# EAGLE design Touch_Drum_V1_Simple (EAGLE 7.7.0)
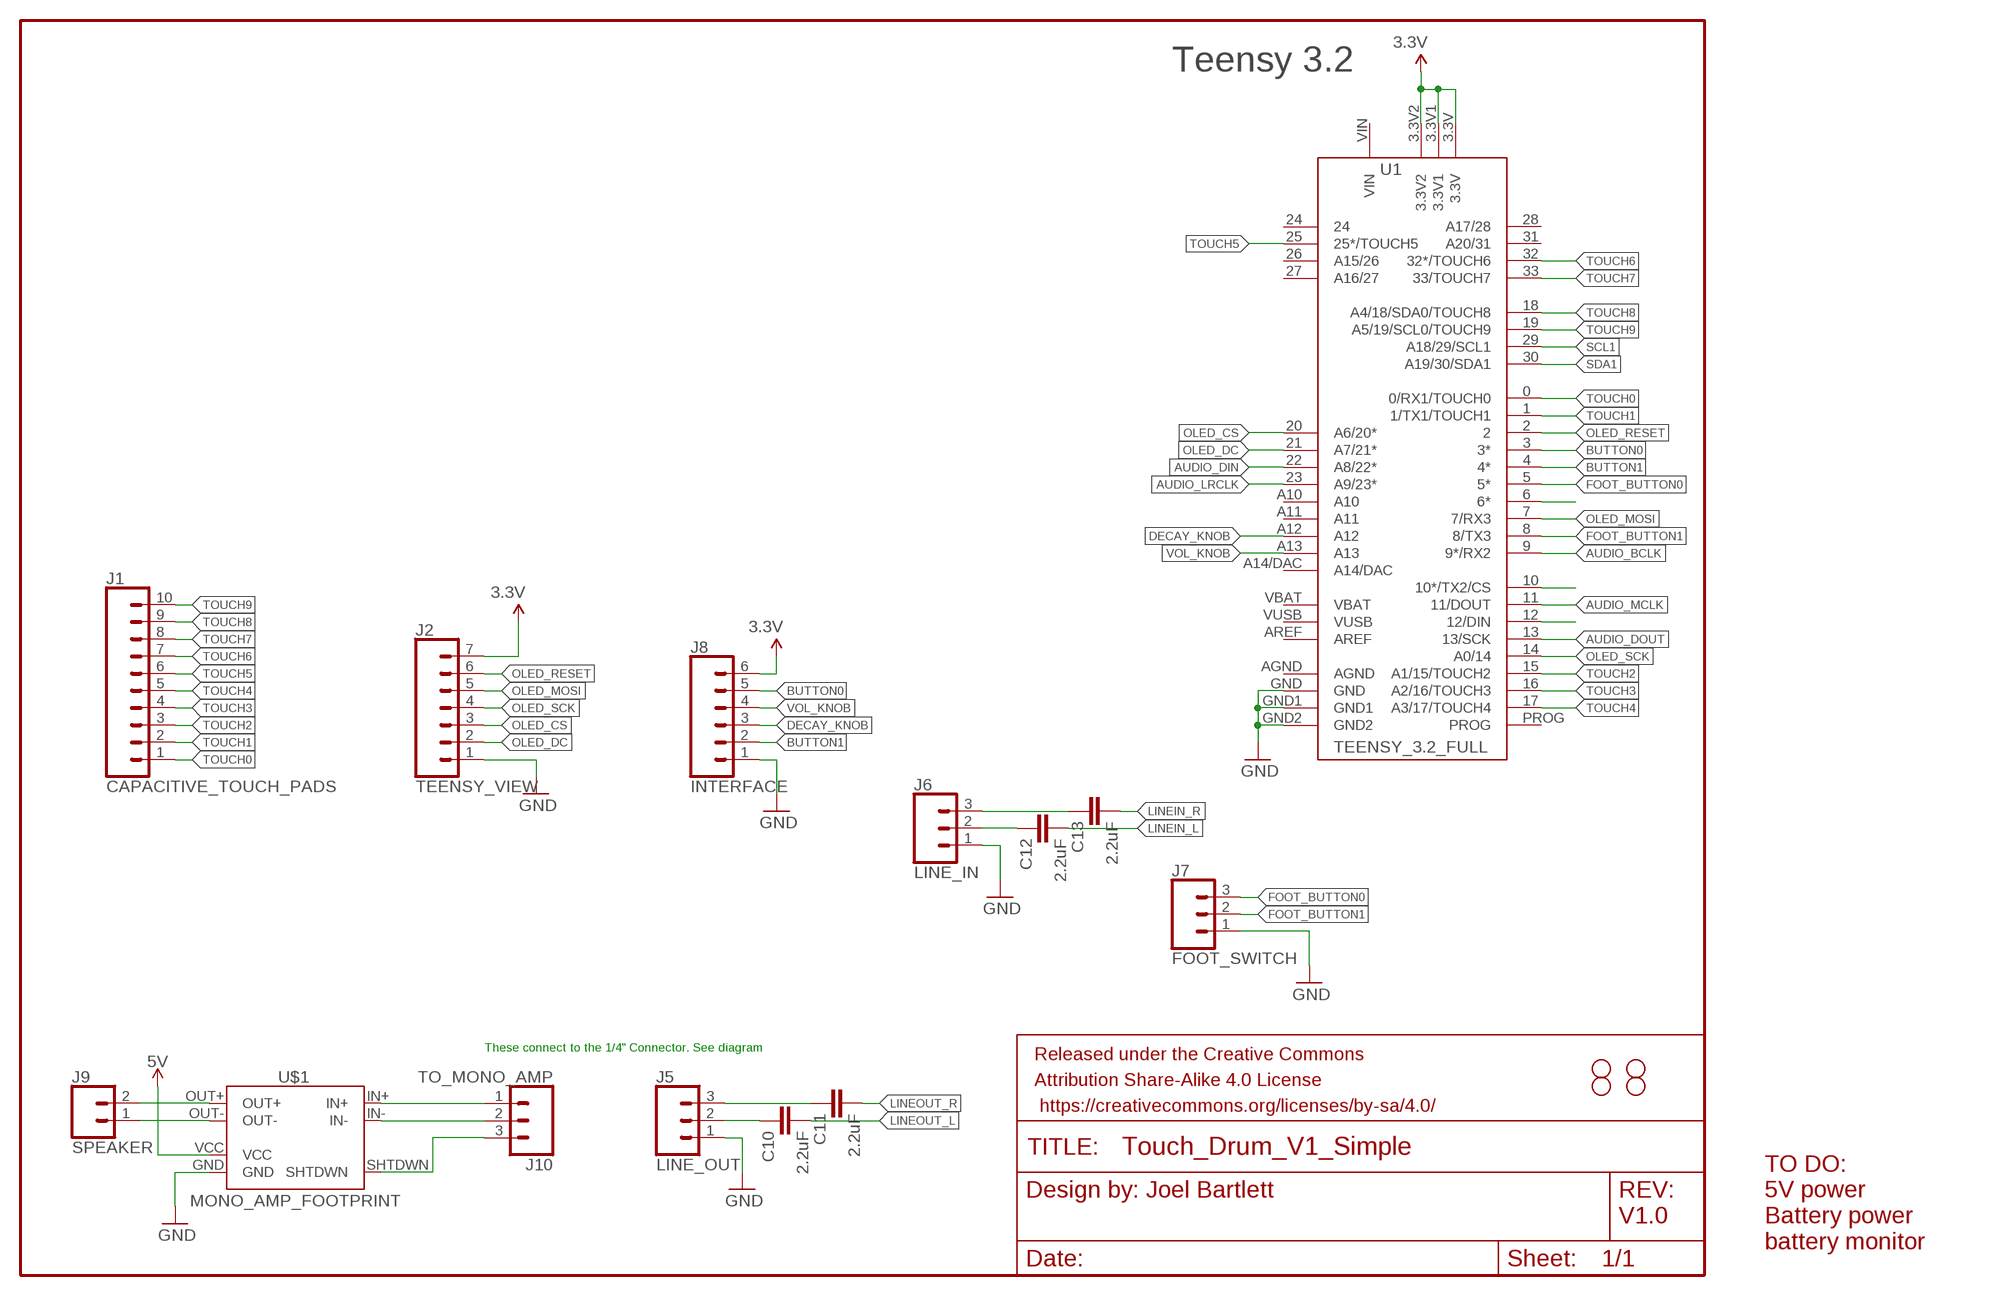
[diagram p0: schematic, sheet 1]

## Parts
C10  2.2uF  2.2UF-0603-10V-20%  [0603]
C11  2.2uF  2.2UF-0603-10V-20%  [0603]
C12  2.2uF  2.2UF-0603-10V-20%  [0603]
C13  2.2uF  2.2UF-0603-10V-20%  [0603]
FRAME1  FRAME-LETTER  [CREATIVE_COMMONS]
H1  STAND-OFF  [STAND-OFF]
H2  STAND-OFF  [STAND-OFF]
H3  STAND-OFF  [STAND-OFF]
H4  STAND-OFF  [STAND-OFF]
J1  CAPACITIVE_TOUCH_PADS  CONN_10NO_SILK_PTH_FEMALE  [1X10_NO_SILK]
J2  TEENSY_VIEW  CONN_07NO_SILK  [1X07_NO_SILK]
J5  LINE_OUT  CONN_03  [1X03]
J6  LINE_IN  CONN_03  [1X03]
J7  FOOT_SWITCH  CONN_03  [1X03]
J8  INTERFACE  CONN_06SILK_FEMALE_PTH  [1X06]
J9  SPEAKER  CONN_02  [1X02]
J10  TO_MONO_AMP  CONN_03  [1X03]
U1  TEENSY_3.2_FULL  [TEENSY_3.2_FULL]
U$1  MONO_AMP_FOOTPRINT  [MONO_AMP_FOOTPRINT]

## Nets
3.3V: J2.7 J8.6 U1.3.3V U1.3.3V1 U1.3.3V2
5V: U$1.VCC
AUDIO_BCLK: U1.9(9*/RX2)
AUDIO_DIN: U1.22(A8/22*)
AUDIO_DOUT: U1.13(13/SCK)
AUDIO_LRCLK: U1.23(A9/23*)
AUDIO_MCLK: U1.11(11/DOUT)
BUTTON0: J8.5 U1.3(3*)
BUTTON1: J8.2 U1.4(4*)
DECAY_KNOB: J8.3 U1.A12
FOOT_BUTTON0: J7.3 U1.5(5*)
FOOT_BUTTON1: J7.2 U1.8(8/TX3)
GND: J2.1 J5.1 J6.1 J7.1 J8.1 U1.GND U1.GND1 U1.GND2 U$1.GND
LINEIN_L: C12.2
LINEIN_R: C13.2
LINEOUT_L: C10.2
LINEOUT_R: C11.2
N$5: U1.6(6*)
N$10: U1.12(12/DIN)
N$12: U1.10(10*/TX2/CS)
N$13: J10.1 U$1.IN+
N$14: C11.1 J5.3
N$15: C10.1 J5.2
N$16: C13.1 J6.3
N$17: C12.1 J6.2
N$18: J10.2 U$1.IN-
N$19: J10.3 U$1.SHTDWN
OLED_CS: J2.3 U1.20(A6/20*)
OLED_DC: J2.2 U1.21(A7/21*)
OLED_MOSI: J2.5 U1.7(7/RX3)
OLED_RESET: J2.6 U1.2
OLED_SCK: J2.4 U1.14(A0/14)
OUT+: J9.2 U$1.OUT+
OUT-: J9.1 U$1.OUT-
SCL1: U1.29(A18/29/SCL1)
SDA1: U1.30(A19/30/SDA1)
TOUCH0: J1.1 U1.0(0/RX1/TOUCH0)
TOUCH1: J1.2 U1.1(1/TX1/TOUCH1)
TOUCH2: J1.3 U1.15(A1/15/TOUCH2)
TOUCH3: J1.4 U1.16(A2/16/TOUCH3)
TOUCH4: J1.5 U1.17(A3/17/TOUCH4)
TOUCH5: J1.6 U1.25(25*/TOUCH5)
TOUCH6: J1.7 U1.32(32*/TOUCH6)
TOUCH7: J1.8 U1.33(33/TOUCH7)
TOUCH8: J1.9 U1.18(A4/18/SDA0/TOUCH8)
TOUCH9: J1.10 U1.19(A5/19/SCL0/TOUCH9)
VOL_KNOB: J8.4 U1.A13
Unconnected: U1.24 U1.26(A15/26) U1.27(A16/27) U1.28(A17/28) U1.31(A20/31) U1.A10 U1.A11 U1.A14/DAC U1.AGND U1.AREF U1.PROG U1.VBAT U1.VIN U1.VUSB

## Notes on the sheet
- Teensy 3.2
- These connect to the 1/4" Connector. See diagram
- Joel Bartlett
- V1.0
- TO DO:
  5V power
  Battery power
  battery monitor

## Library data of the parts
C10-C13 = SparkFun-Capacitors:2.2UF: 2.2µF ceramic capacitors A capacitor is a passive two-terminal electrical component used to store electrical energy temporarily in an electric field.; PROD_ID: CAP-07888
FRAME1 = SparkFun-Aesthetics:FRAME-LETTER: Schematic Frame - Letter Standard 8.5x11 US Letter frame
H1-H4 = SparkFun-Hardware:STAND-OFF: Stand Off Drill holes for mechanically mounting via screws, standoffs, etc. Note: Use the keepout ring to avoid running the screw head into surrounding components. Variant Overviews STAND-OFF - Mechanical footprint for a #4 phillips button head screw. STAND-OFF-TIGHT - Mechanical footprint for a #4 phillips button head screw, Example SparkFun Products Screw - Phillips Head (1/4", 4-40, 10 pack) <https://www.sparkfun.com/products/10453> (PRT-10453) Screw - Phillips Head (1/2", 4-40, 10 pack) <https://www.sparkfun.com/products/10452> (PRT-10452) Screw - Phillips Head (3/4", 4-40, 10 pack) <https://www.sparkfun.com/products/10451> (PRT-10451) Screw - Phillips Head (1", 4-40, 10 pack) <https://www.sparkfun.com/products/10450> (PRT-10450)
J1 = SparkFun-Connectors:CONN_10: Multi connection point. Often used as Generic Header-pin footprint for 0.1 inch spaced/style header connections On any of the 0.1 inch spaced packages, you can populate with these: Break Away Headers - Straight <https://www.sparkfun.com/products/116> (PRT-00116) Break Away Male Headers - Right Angle <https://www.sparkfun.com/products/553> (PRT-00553) Female Headers <https://www.sparkfun.com/products/115> (PRT-00115) Break Away Headers - Machine Pin <https://www.sparkfun.com/products/117> (PRT-00117) Break Away Female Headers - Swiss Machine Pin <https://www.sparkfun.com/products/743> (PRT-00743) Arduino Stackable Header - 10 Pin <https://www.sparkfun.com/products/11376> (PRT-11376) For SCREWTERMINALS and SPRING TERMINALS visit here: Screw Terimnals on SparkFun.com <https://www.sparkfun.com/search/results?term=Screw+Terminals> (5mm/3.5mm/2.54mm spacing) This device is also useful as a general connection point to wire up your design to another part of your project. Our various solder wires solder well into these plated through hole pads. Hook-Up Wire - Assortment (Stranded, 22 AWG) <https://www.sparkfun.com/products/11375> (PRT-11375) Hook-Up Wire - Assortment (Solid Core, 22 AWG) <https://www.sparkfun.com/products/11367> (PRT-11367) View the entire wire category on our website here <https://www.sparkfun.com/categories/141> Special notes: Molex polarized connector foot print use with SKU : PRT-08231 with associated crimp pins and housings. 1MM SMD Version SKU: PRT-10208 NOTES ON THE VARIANTS LOCK and LOCK_LONGPADS... This footprint was designed to help hold the alignment of a through-hole component (i.e. 6-pin header) while soldering it into place. You may notice that each hole has been shifted either up or down by 0.005 of an inch from it's more standard position (which is a perfectly straight line). This slight alteration caused the pins (the squares in the middle) to touch the edges of the holes. Because they are alternating, it causes a "brace" to hold the component in place. 0.005 has proven to be the perfect amount of "off-center" position when using our standard breakaway headers. Although looks a little odd when you look at the bare footprint, once you have a header in there, the alteration is very hard to notice. Also,if you push a header all the way into place, it is covered up entirely on the bottom side.; PROD_ID: CONN-11563
J2 = SparkFun-Connectors:CONN_07: Multi connection point. Often used as Generic Header-pin footprint for 0.1 inch spaced/style header connections On any of the 0.1 inch spaced packages, you can populate with these: Break Away Headers - Straight <https://www.sparkfun.com/products/116> (PRT-00116) Break Away Male Headers - Right Angle <https://www.sparkfun.com/products/553> (PRT-00553) Female Headers <https://www.sparkfun.com/products/115> (PRT-00115) Break Away Headers - Machine Pin <https://www.sparkfun.com/products/117> (PRT-00117) Break Away Female Headers - Swiss Machine Pin <https://www.sparkfun.com/products/743> (PRT-00743) For SCREWTERMINALS and SPRING TERMINALS visit here: Screw Terimnals on SparkFun.com <https://www.sparkfun.com/search/results?term=Screw+Terminals> (5mm/3.5mm/2.54mm spacing) This device is also useful as a general connection point to wire up your design to another part of your project. Our various solder wires solder well into these plated through hole pads. Hook-Up Wire - Assortment (Stranded, 22 AWG) <https://www.sparkfun.com/products/11375> (PRT-11375) Hook-Up Wire - Assortment (Solid Core, 22 AWG) <https://www.sparkfun.com/products/11367> (PRT-11367) View the entire wire category on our website here <https://www.sparkfun.com/categories/141> Special notes: Molex polarized connector foot print use with SKU : PRT-08231 with associated crimp pins and housings. 1MM SMD Version SKU: PRT-10208 NOTES ON THE VARIANTS LOCK and LOCK_LONGPADS... This footprint was designed to help hold the alignment of a through-hole component (i.e. 6-pin header) while soldering it into place. You may notice that each hole has been shifted either up or down by 0.005 of an inch from it's more standard position (which is a perfectly straight line). This slight alteration caused the pins (the squares in the middle) to touch the edges of the holes. Because they are alternating, it causes a "brace" to hold the component in place. 0.005 has proven to be the perfect amount of "off-center" position when using our standard breakaway headers. Although looks a little odd when you look at the bare footprint, once you have a header in there, the alteration is very hard to notice. Also,if you push a header all the way into place, it is covered up entirely on the bottom side.
J5-J7 J10 = SparkFun-Connectors:CONN_03: Multi connection point. Often used as Generic Header-pin footprint for 0.1 inch spaced/style header connections On any of the 0.1 inch spaced packages, you can populate with these: Break Away Headers - Straight <https://www.sparkfun.com/products/116> (PRT-00116) Break Away Male Headers - Right Angle <https://www.sparkfun.com/products/553> (PRT-00553) Female Headers <https://www.sparkfun.com/products/115> (PRT-00115) Break Away Headers - Machine Pin <https://www.sparkfun.com/products/117> (PRT-00117) Break Away Female Headers - Swiss Machine Pin <https://www.sparkfun.com/products/743> (PRT-00743) Stackable Header - 3 Pin (Female, 0.1") <https://www.sparkfun.com/products/13875> (PRT-13875) For SCREWTERMINALS and SPRING TERMINALS visit here: Screw Terimnals on SparkFun.com <https://www.sparkfun.com/search/results?term=Screw+Terminals> (5mm/3.5mm/2.54mm spacing) This device is also useful as a general connection point to wire up your design to another part of your project. Our various solder wires solder well into these plated through hole pads. Hook-Up Wire - Assortment (Stranded, 22 AWG) <https://www.sparkfun.com/products/11375> (PRT-11375) Hook-Up Wire - Assortment (Solid Core, 22 AWG) <https://www.sparkfun.com/products/11367> (PRT-11367) View the entire wire category on our website here <https://www.sparkfun.com/categories/141> Special notes: Molex polarized connector foot print use with SKU : PRT-08232 with associated crimp pins and housings.; PROD_ID: XXX-00000; VALUE: 455-1750-1-ND
J8 = SparkFun-Connectors:CONN_06: Multi connection point. Often used as Generic Header-pin footprint for 0.1 inch spaced/style header connections On any of the 0.1 inch spaced packages, you can populate with these: Break Away Headers - Straight <https://www.sparkfun.com/products/116> (PRT-00116) Break Away Male Headers - Right Angle <https://www.sparkfun.com/products/553> (PRT-00553) Female Headers <https://www.sparkfun.com/products/115> (PRT-00115) Break Away Headers - Machine Pin <https://www.sparkfun.com/products/117> (PRT-00117) Break Away Female Headers - Swiss Machine Pin <https://www.sparkfun.com/products/743> (PRT-00743) Arduino Stackable Header - 6 Pin <https://www.sparkfun.com/products/9280> (PRT-09280) For SCREWTERMINALS and SPRING TERMINALS visit here: Screw Terimnals on SparkFun.com <https://www.sparkfun.com/search/results?term=Screw+Terminals> (5mm/3.5mm/2.54mm spacing) This device is also useful as a general connection point to wire up your design to another part of your project. Our various solder wires solder well into these plated through hole pads. Hook-Up Wire - Assortment (Stranded, 22 AWG) <https://www.sparkfun.com/products/11375> (PRT-11375) Hook-Up Wire - Assortment (Solid Core, 22 AWG) <https://www.sparkfun.com/products/11367> (PRT-11367) View the entire wire category on our website here <https://www.sparkfun.com/categories/141>; PROD_ID: CONN-08437
J9 = SparkFun-Connectors:CONN_02: Multi connection point. Often used as Generic Header-pin footprint for 0.1 inch spaced/style header connections On any of the 0.1 inch spaced packages, you can populate with these: Break Away Headers - Straight <https://www.sparkfun.com/products/116> (PRT-00116) Break Away Male Headers - Right Angle <https://www.sparkfun.com/products/553> (PRT-00553) Female Headers <https://www.sparkfun.com/products/115> (PRT-00115) Break Away Headers - Machine Pin <https://www.sparkfun.com/products/117> (PRT-00117) Break Away Female Headers - Swiss Machine Pin <https://www.sparkfun.com/products/743> (PRT-00743) For SCREWTERMINALS and SPRING TERMINALS visit here: Screw Terimnals on SparkFun.com <https://www.sparkfun.com/search/results?term=Screw+Terminals> (5mm/3.5mm/2.54mm spacing) This device is also useful as a general connection point to wire up your design to another part of your project. Our various solder wires solder well into these plated through hole pads. Hook-Up Wire - Assortment (Stranded, 22 AWG) <https://www.sparkfun.com/products/11375> (PRT-11375) Hook-Up Wire - Assortment (Solid Core, 22 AWG) <https://www.sparkfun.com/products/11367> (PRT-11367) View the entire wire category on our website here <https://www.sparkfun.com/categories/141> Special notes: Molex polarized connector foot print use with: PRT-08233 with associated crimp pins and housings. 2.54_SCREWTERM for use with PRT-10571. 3.5mm Screw Terminal footprints for PRT-08084 5mm Screw Terminal footprints for use with PRT-08432
U1 = Openponics:TEENSY_3.2_FULL
U$1 = Openponics:MONO_AMP_FOOTPRINT

## Net classes
0 default: width 0.203 mm
1 vcc: width 0.254 mm

## Board
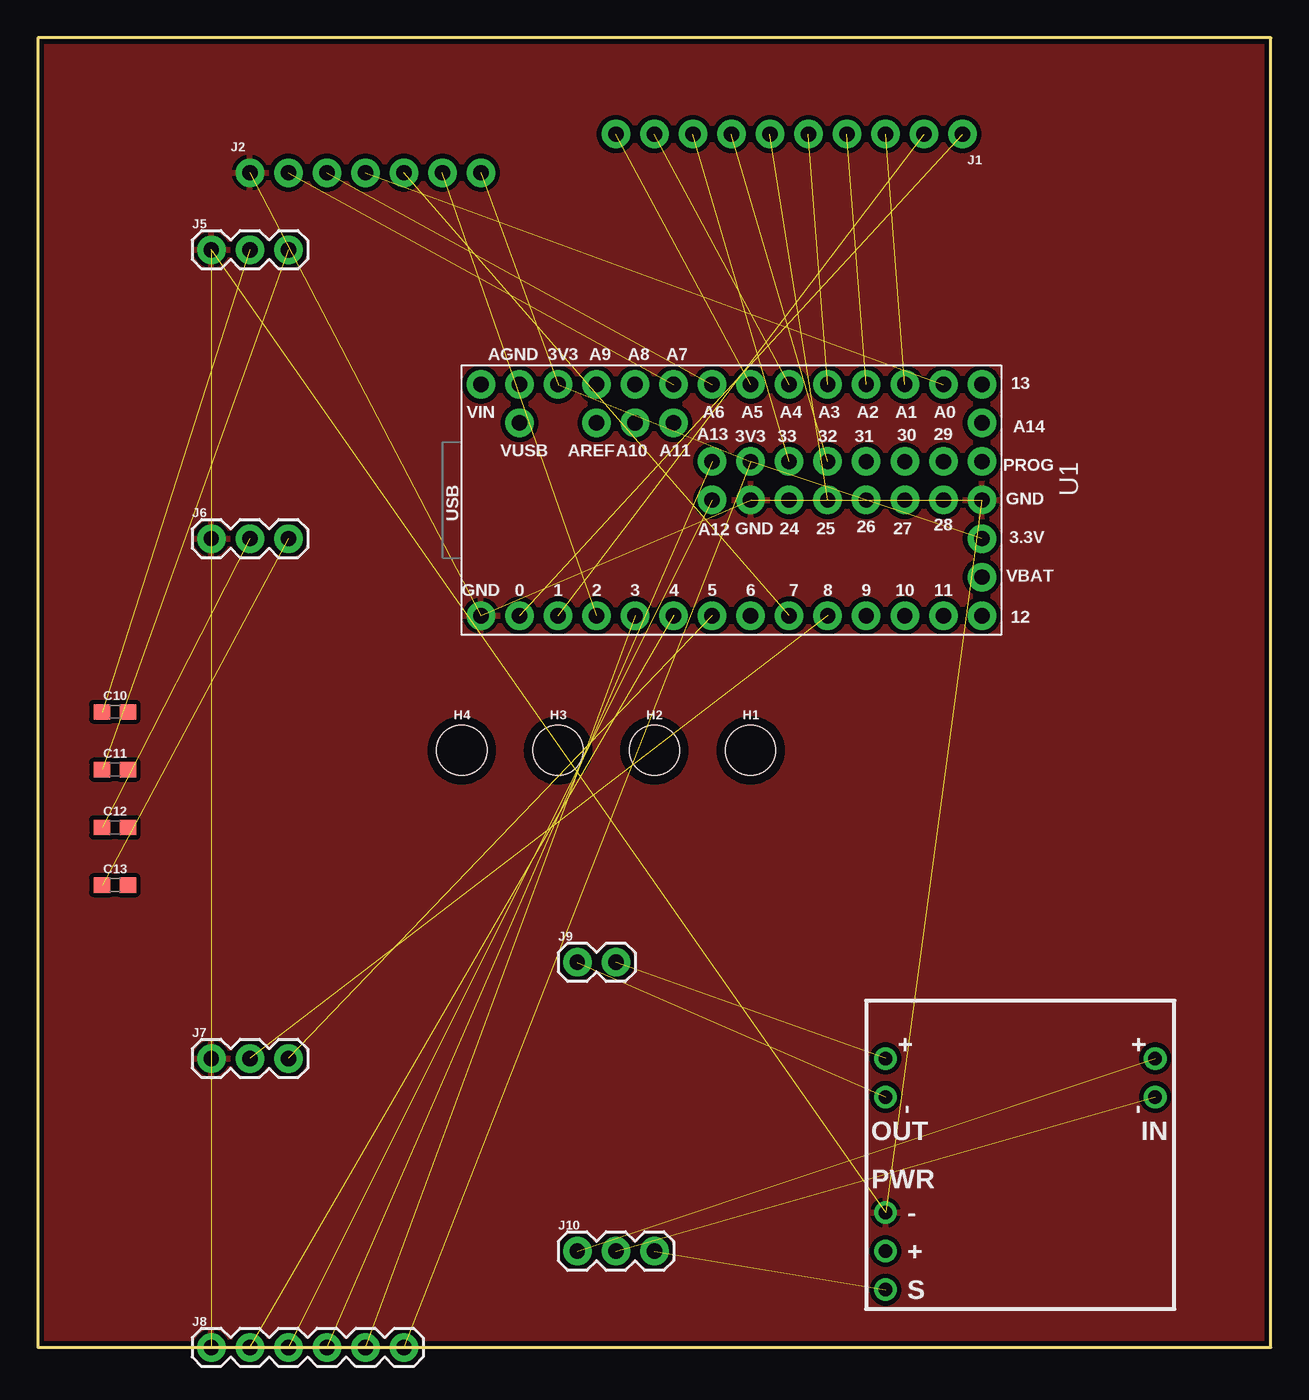
[diagram p1: board, top side]
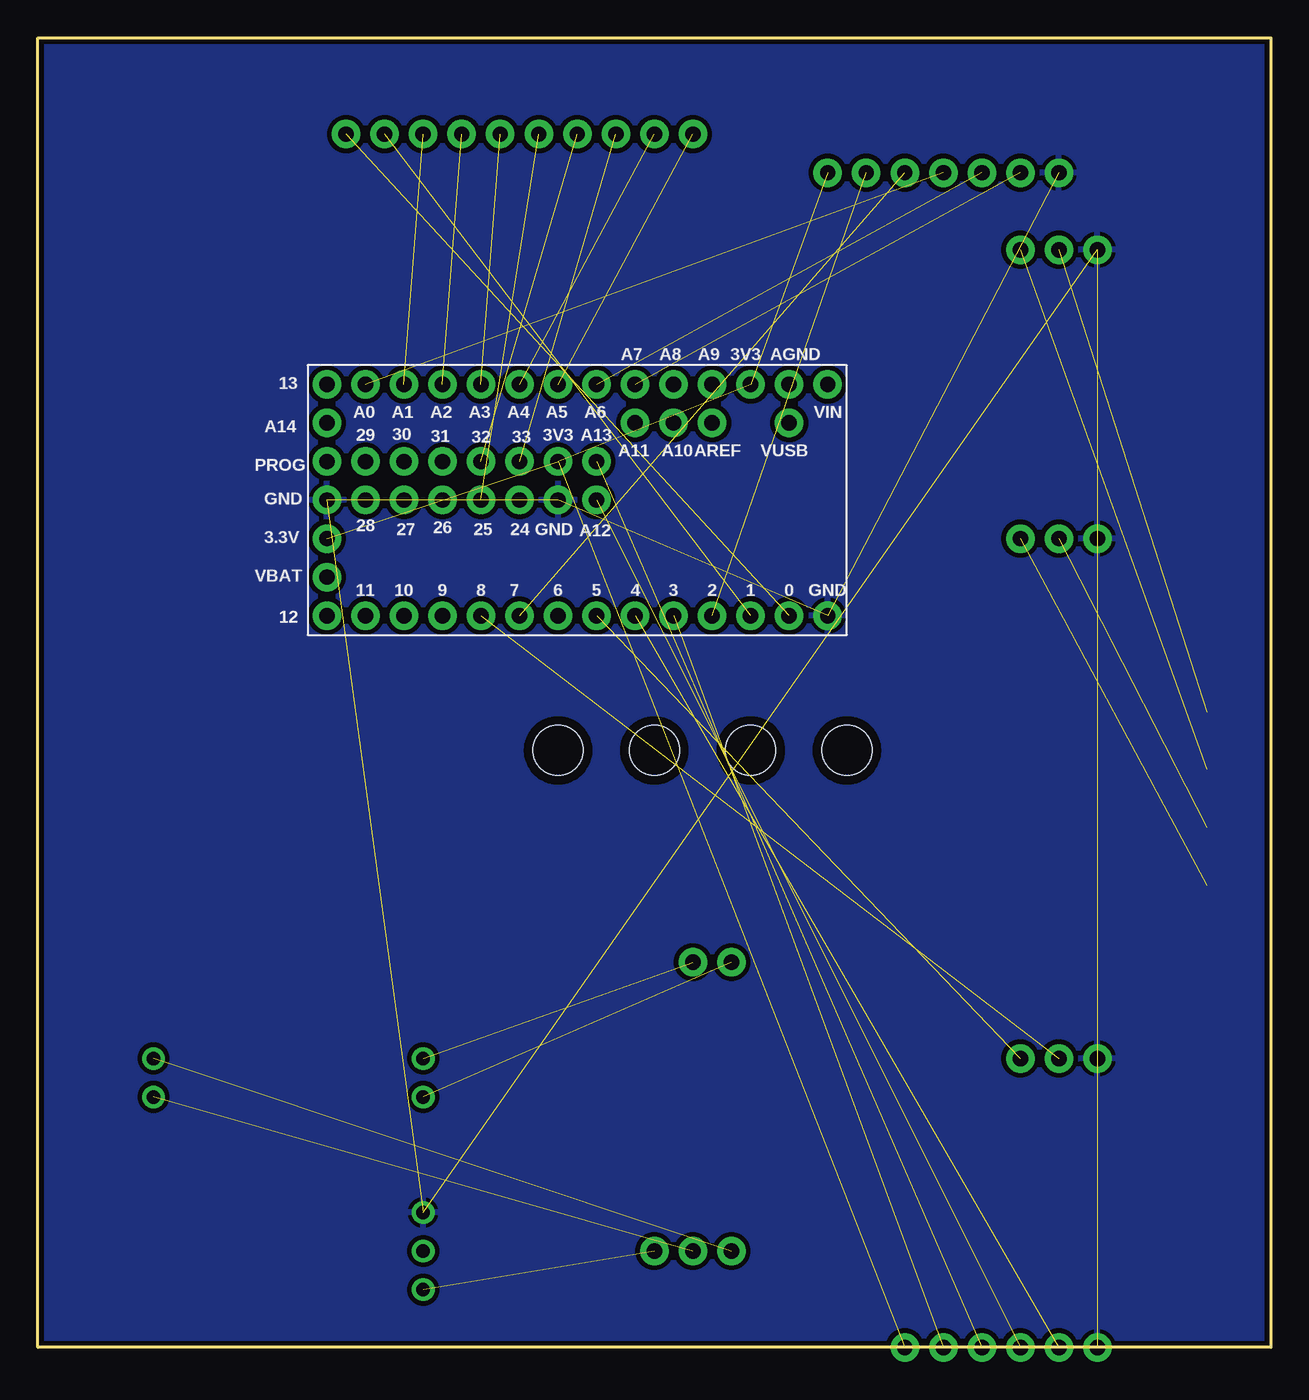
[diagram p2: board, bottom side, seen from below]

Size 81.28 x 86.36 mm. Coordinates in mm from the lower left corner, seen from the top.
Outline: 0,0 81.28,0 81.28,86.36 0,86.36 0,0
Copper layers (1*16): Top 0.035mm / dielectric 1.5mm / Bottom 0.035mm
Design rules "SparkFun-2-layer": minimum track width 7mil, minimum drill 15mil, track to track 8mil, track to pad 8mil, pad to pad 8mil, via to via 8mil, smd to smd 8mil, copper to edge 8mil, drill to drill 8mil, minimum pad ring 12mil, minimum via ring 10mil, stop-mask expansion 4mil, vias tented up to drill 20mil, thermal gap 10mil

### Footprints (pad centres in the part's own frame; a part is rotated, then mirrored left to right if it is on the bottom)
0603 = smd 1.1 x 1: 1 -0.85,0; 2 0.85,0
STAND-OFF = hole 3.302: 0,0
1X10_NO_SILK = drill 1.016 pad 1.88: 1 0,0; 2 2.54,0; 3 5.08,0; 4 7.62,0; 5 10.16,0; 6 12.7,0; 7 15.24,0; 8 17.78,0; 9 20.32,0; 10 22.86,0
1X07_NO_SILK = drill 1.016 pad 1.88: 1 0,0; 2 2.54,0; 3 5.08,0; 4 7.62,0; 5 10.16,0; 6 12.7,0; 7 15.24,0
1X03 = drill 1.016 pad 1.88: 1 0,0; 2 2.54,0; 3 5.08,0
1X06 = drill 1.016 pad 1.88: 1 0,0; 2 2.54,0; 3 5.08,0; 4 7.62,0; 5 10.16,0; 6 12.7,0
1X02 = drill 1.016 pad 1.88: 1 0,0; 2 2.54,0
TEENSY_3.2_FULL = drill 1.016 pad 1.88: 0 7.62,-13.97; 1 7.62,-11.43; 2 7.62,-8.89; 3 7.62,-6.35; 3.3V 2.54,16.51; 3.3V1 -7.62,-11.43; 3.3V2 -2.54,1.27; 4 7.62,-3.81; 5 7.62,-1.27; 6 7.62,1.27; 7 7.62,3.81; 8 7.62,6.35; 9 7.62,8.89; 10 7.62,11.43; 11 7.62,13.97; 12 7.62,16.51; 13 -7.62,16.51; 14 -7.62,13.97; 15 -7.62,11.43; 16 -7.62,8.89; 17 -7.62,6.35; 18 -7.62,3.81; 19 -7.62,1.27; 20 -7.62,-1.27; 21 -7.62,-3.81; 22 -7.62,-6.35; 23 -7.62,-8.89; 24 0,3.81; 25 0,6.35; 26 0,8.89; 27 0,11.43; 28 0,13.97; 29 -2.54,13.97; 30 -2.54,11.43; 31 -2.54,8.89; 32 -2.54,6.35; 33 -2.54,3.81; A10 -5.08,-6.35; A11 -5.08,-3.81; A12 0,-1.27; A13 -2.54,-1.27; A14/DAC -5.08,16.51; AGND -7.62,-13.97; AREF -5.08,-8.89; GND 0,16.51; GND1 7.62,-16.51; GND2 0,1.27; PROG -2.54,16.51; VBAT 5.08,16.51; VIN -7.62,-16.51; VUSB -5.08,-13.97
MONO_AMP_FOOTPRINT = drill 0.889 pad 1.473: GND -8.89,-3.81; IN+ 8.89,6.35; IN- 8.89,3.81; OUT+ -8.89,6.35; OUT- -8.89,3.81; SHTDWN -8.89,-8.89; VCC -8.89,-6.35

### Placement (x,y rotation side)
C10  5.08,41.91 0 top
C11  5.08,38.1 0 top
C12  5.08,34.29 0 top
C13  5.08,30.48 0 top
FRAME1  10.16,-12.7 0 top  (outside the outline)
H1  46.99,39.37 0 top
H2  40.64,39.37 0 top
H3  34.29,39.37 0 top
H4  27.94,39.37 0 top
J1  60.96,80.01 180 top
J2  13.97,77.47 0 top
J5  11.43,72.39 0 top
J6  11.43,53.34 0 top
J7  11.43,19.05 0 top
J8  11.43,0 0 top
J9  35.56,25.4 0 top
J10  35.56,6.35 0 top
U1  45.72,55.88 270 top
U$1  64.77,12.7 0 top

### Tracks (layer width: path | path; a pad name or v marks a point on that pad's centre or on a via)
3.3V  (4 unrouted)
BUTTON0  (1 unrouted)
BUTTON1  (1 unrouted)
DECAY_KNOB  (1 unrouted)
FOOT_BUTTON0  (1 unrouted)
FOOT_BUTTON1  (1 unrouted)
GND  (8 unrouted)
  pour Top (isolate 0.305): 0,86.36 81.28,86.36 81.28,0 0,0
  pour Bottom (isolate 0.305): 0,86.36 81.28,86.36 81.28,0 0,0
  pour Bottom (isolate 0.305): 0,86.36 81.28,86.36 81.28,0 0,0
N$13  (1 unrouted)
N$14  (1 unrouted)
N$15  (1 unrouted)
N$16  (1 unrouted)
N$17  (1 unrouted)
N$18  (1 unrouted)
N$19  (1 unrouted)
OLED_CS  (1 unrouted)
OLED_DC  (1 unrouted)
OLED_MOSI  (1 unrouted)
OLED_RESET  (1 unrouted)
OLED_SCK  (1 unrouted)
OUT+  (1 unrouted)
OUT-  (1 unrouted)
TOUCH0  (1 unrouted)
TOUCH1  (1 unrouted)
TOUCH2  (1 unrouted)
TOUCH3  (1 unrouted)
TOUCH4  (1 unrouted)
TOUCH5  (1 unrouted)
TOUCH6  (1 unrouted)
TOUCH7  (1 unrouted)
TOUCH8  (1 unrouted)
TOUCH9  (1 unrouted)
VOL_KNOB  (1 unrouted)

### Text on the board
Measures: Units in inches
tDocu: Joel Bartlett